# Altium schematic sheet Power_VtopControl.SchDoc
size A; SheetNumber: 9
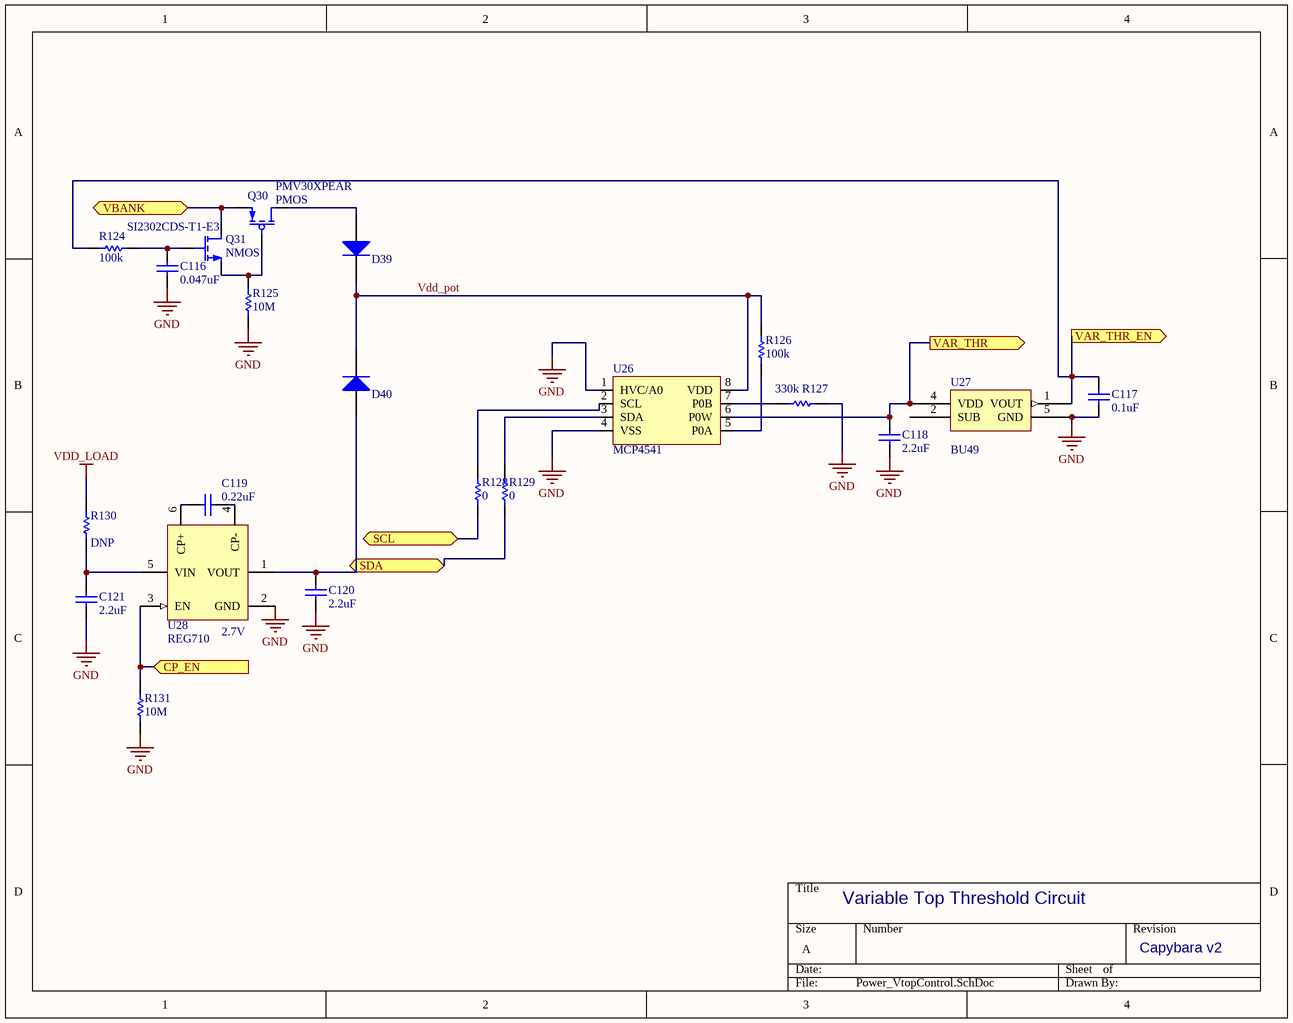
[diagram p0: Power_VtopControl.SchDoc]

## Parts
C116  value 0.047uF  [0603]  (hidden comment: Cap)
C117  value 0.1uF  [0603]  (hidden comment: Cap)
C118  value 2.2uF  [0603]  (hidden comment: Cap)
C119  value 0.22uF  [0603]  (hidden comment: Cap)
C120  value 2.2uF  [0603]  (hidden comment: Cap)
C121  value 2.2uF  [0603]  (hidden comment: Cap)
D39  Diode  [SOD-523]  (value not drawn)
D40  Diode  [SOD-523]  (value not drawn)
Q30  PMOS  Manufacturer Part Number: PMV30XPEAR  [SOT23 - N]
Q31  NMOS  Manufacturer Part Number: SI2302CDS-T1-E3  [SOT23 - N]
R124  value 100k  [0603]  (hidden comment: Res)
R125  value 10M  [0603]  (hidden comment: Res)
R126  value 100k  [0603]  (hidden comment: Res)
R127  value 330k  [0603]  (hidden comment: Resistor)
R128  value 0  [0603]  (hidden comment: Resistor)
R129  value 0  [0603]  (hidden comment: Resistor)
R130  value DNP  [0603]  (hidden comment: Res)
R131  value 10M  [0603]  (hidden comment: Res)
U26  MCP4541  [MSOP8]
U27  BU49  [SOP4]
U28  REG710  value 2.7V  [SOT23-6]

## Ports
CP_EN (in), SCL, SDA, VAR_THR (out), VAR_THR_EN (out), VBANK

## Nets
GND: C116.1 C117.1 C118.1 C120.1 C121.1 R125.1 R127.1 R131.1 U26.1(HVC/A0) U26.4(VSS) U27.5(GND) U28.2(GND)
VDD_LOAD: R130.1
CP_EN: R131.2 U28.3(EN) ; port CP_EN
SCL: R128.1 ; port SCL
SDA: R129.1 ; port SDA
VAR_THR: C118.2 U26.6(P0W) U27.4(VDD) ; port VAR_THR
VAR_THR_EN: C117.2 R124.1 U27.1(VOUT) ; port VAR_THR_EN
VBANK: Q30.2(S) Q31.3(D) ; port VBANK
Vdd_pot: D39.2(C) D40.2(C) R126.2 U26.8(VDD)
NetC116_2: C116.2 Q31.1(G) R124.2
NetC119_1: C119.1 U28.4(CP-)
NetC119_2: C119.2 U28.6(CP+)
NetC120_2: C120.2 D40.1(A) U28.1(VOUT)
NetC121_2: C121.2 R130.2 U28.5(VIN)
NetD39_1: D39.1(A) Q30.3(D)
NetQ30_1: Q30.1(G) Q31.2(S) R125.2
NetR126_1: R126.1 U26.5(P0A)
NetR127_2: R127.2 U26.7(P0B)
NetR128_2: R128.2 U26.2(SCL)
NetR129_2: R129.2 U26.3(SDA)

Not connected (* = marked no-connect by the designer): U27 2(SUB)

## Notes on the sheet
- Variable Top Threshold Circuit
- Capybara v2

## Library data of the parts
C116 = Cap: Ceramic Capacitor (Surface Mount); Manufacturer: Murata Electronics North America; Manufacturer Part Number: GRM188R71H473KA61D; Digi-Key Part Number: *; Note: *; Rating: *; Distributor Part Number: 490-3287-1-ND; Distributor: Digi-Key
C117 = Cap: Ceramic Capacitor (Surface Mount); Manufacturer: Murata Electronics North America; Manufacturer Part Number: GRM188R71C104KA01D; Digi-Key Part Number: *; Note: *; Rating: *; Distributor Part Number: 490-1532-1-ND; Distributor: Digi-Key
C118 C120 C121 = Cap: Ceramic Capacitor (Surface Mount); Manufacturer: Murata Electronics North America; Manufacturer Part Number: GRM188R61C225KE15D; Digi-Key Part Number: *; Note: *; Rating: *; Distributor Part Number: 490-3296-1-ND; Distributor: Digi-Key
C119 = Cap: Ceramic Capacitor (Surface Mount); Manufacturer: Murata Electronics North America; Manufacturer Part Number: GRM188R71E224KA88D; Digi-Key Part Number: *; Note: *; Rating: *; Distributor Part Number: 490-3290-1-ND; Distributor: Digi-Key
D39 D40 = Diode: General Purpose Diode; Manufacturer: Vishay Semiconductor; Manufacturer Part Number: BAS40-02V-V-G-08; Digi-Key Part Number: BAS40-02V-V-G-08GICT-ND; Value: *; Rating: *; Note: *; Distributor Part Number: 78-BAS40-02V-V-G-08; Distributor: Mouser; Mouser Part Number: 78-BAS40-02V-V-G-08
Q30 = MOSFET-P: P-Channel MOSFET; Manufacturer: Nexperia; Digi-Key Part Number: 1727-2531-1-ND; Note: *; Rating: *; Distributor: Mouser; Distributor Part Number: 771-PMV30XPEAR; Value: PMOS; Mouser Part Number: 771-PMV30XPEAR
Q31 = MOSFET-N: N-Channel MOSFET; Manufacturer: Vishay Siliconix; Digi-Key Part Number: SI2302CDS-T1-E3CT-ND; Note: *; Rating: *; Value: NMOS; Distributor: Mouser; Distributor Part Number: 781-SI2302CDS-E3; Mouser Part Number: 781-SI2302CDS-E3
R124 R126 = Res: Chip Resistor (Surface Mount); Manufacturer: Yageo; Manufacturer Part Number: RT0603FRE07100KL; Digi-Key Part Number: *; Rating: *; Distributor: Digi-Key; Distributor Part Number: YAG2319CT-ND
  R124: Note: *
R125 R131 = Res: Chip Resistor (Surface Mount); Manufacturer: Yageo; Manufacturer Part Number: RC0603JR-0710ML; Digi-Key Part Number: *; Rating: *; Note: *; Distributor: Digi-Key; Distributor Part Number: 311-10MGRCT-ND
R127 = Res: Chip Resistor (Surface Mount); Manufacturer: Yageo; Manufacturer Part Number: RC0603FR-07330KL; Rating: *; Distributor: Digi-Key; Distributor Part Number: 311-330KHRCT-ND
R128 R129 = Res: Chip Resistor (Surface Mount); Manufacturer: Yageo; Manufacturer Part Number: RC0603JR-070RL; Rating: *; Distributor: Digi-Key; Distributor Part Number: 311-0.0GRCT-ND
R130 = Res: Chip Resistor (Surface Mount); Manufacturer: Generic Chip Res (TBD); Manufacturer Part Number: *; Digi-Key Part Number: *; Rating: *
U26 = MCP4541: Manufacturer: Microchip; Manufacturer Part Number: MCP4541T-104E/MS; Digi-Key Part Number: MCP4541-104E/MS-ND; Distributor: Mouser; Distributor Part Number: 579-MCP4541-104E/MS; Mouser Part Number: 579-MCP4541-104E/MS
U27 = BU49: IC DETECTOR CMOS; pin to pad: 2>3 4>2 5>4; Manufacturer: ROHM Semiconductor; Manufacturer Part Number: BU4917F-TR; Name: BU49; Digi-Key Part Number: BU4917F-TR-ND; Distributor: Quest Components; Distributor Part Number: BU4917F-TR; Mouser Part Number: 755-BU4917F-TR
U28 = REG710: Manufacturer: Texas Instruments; Manufacturer Part Number: REG710NA-2.7/250; Digi-Key Part Number: 296-12134-1-ND; Distributor: Mouser; Distributor Part Number: 595-REG710NA-2.7/250; Mouser Part Number: 595-REG710NA-2.7/250